# Altium schematic sheet Schéma_Global.SchDoc
size A3; Author: LDA; Organization: ETML-ES; Address1: Avenue Recordon 1; Address2: 1004 Lausanne; Address3: Switzerland; Revision: 1.0; SheetNumber: 1; SheetTotal: 2; SPICEModelCacheBXXOXYNL: <root> / <DocumentId>BXXOXYNL</DocumentId> / </root>
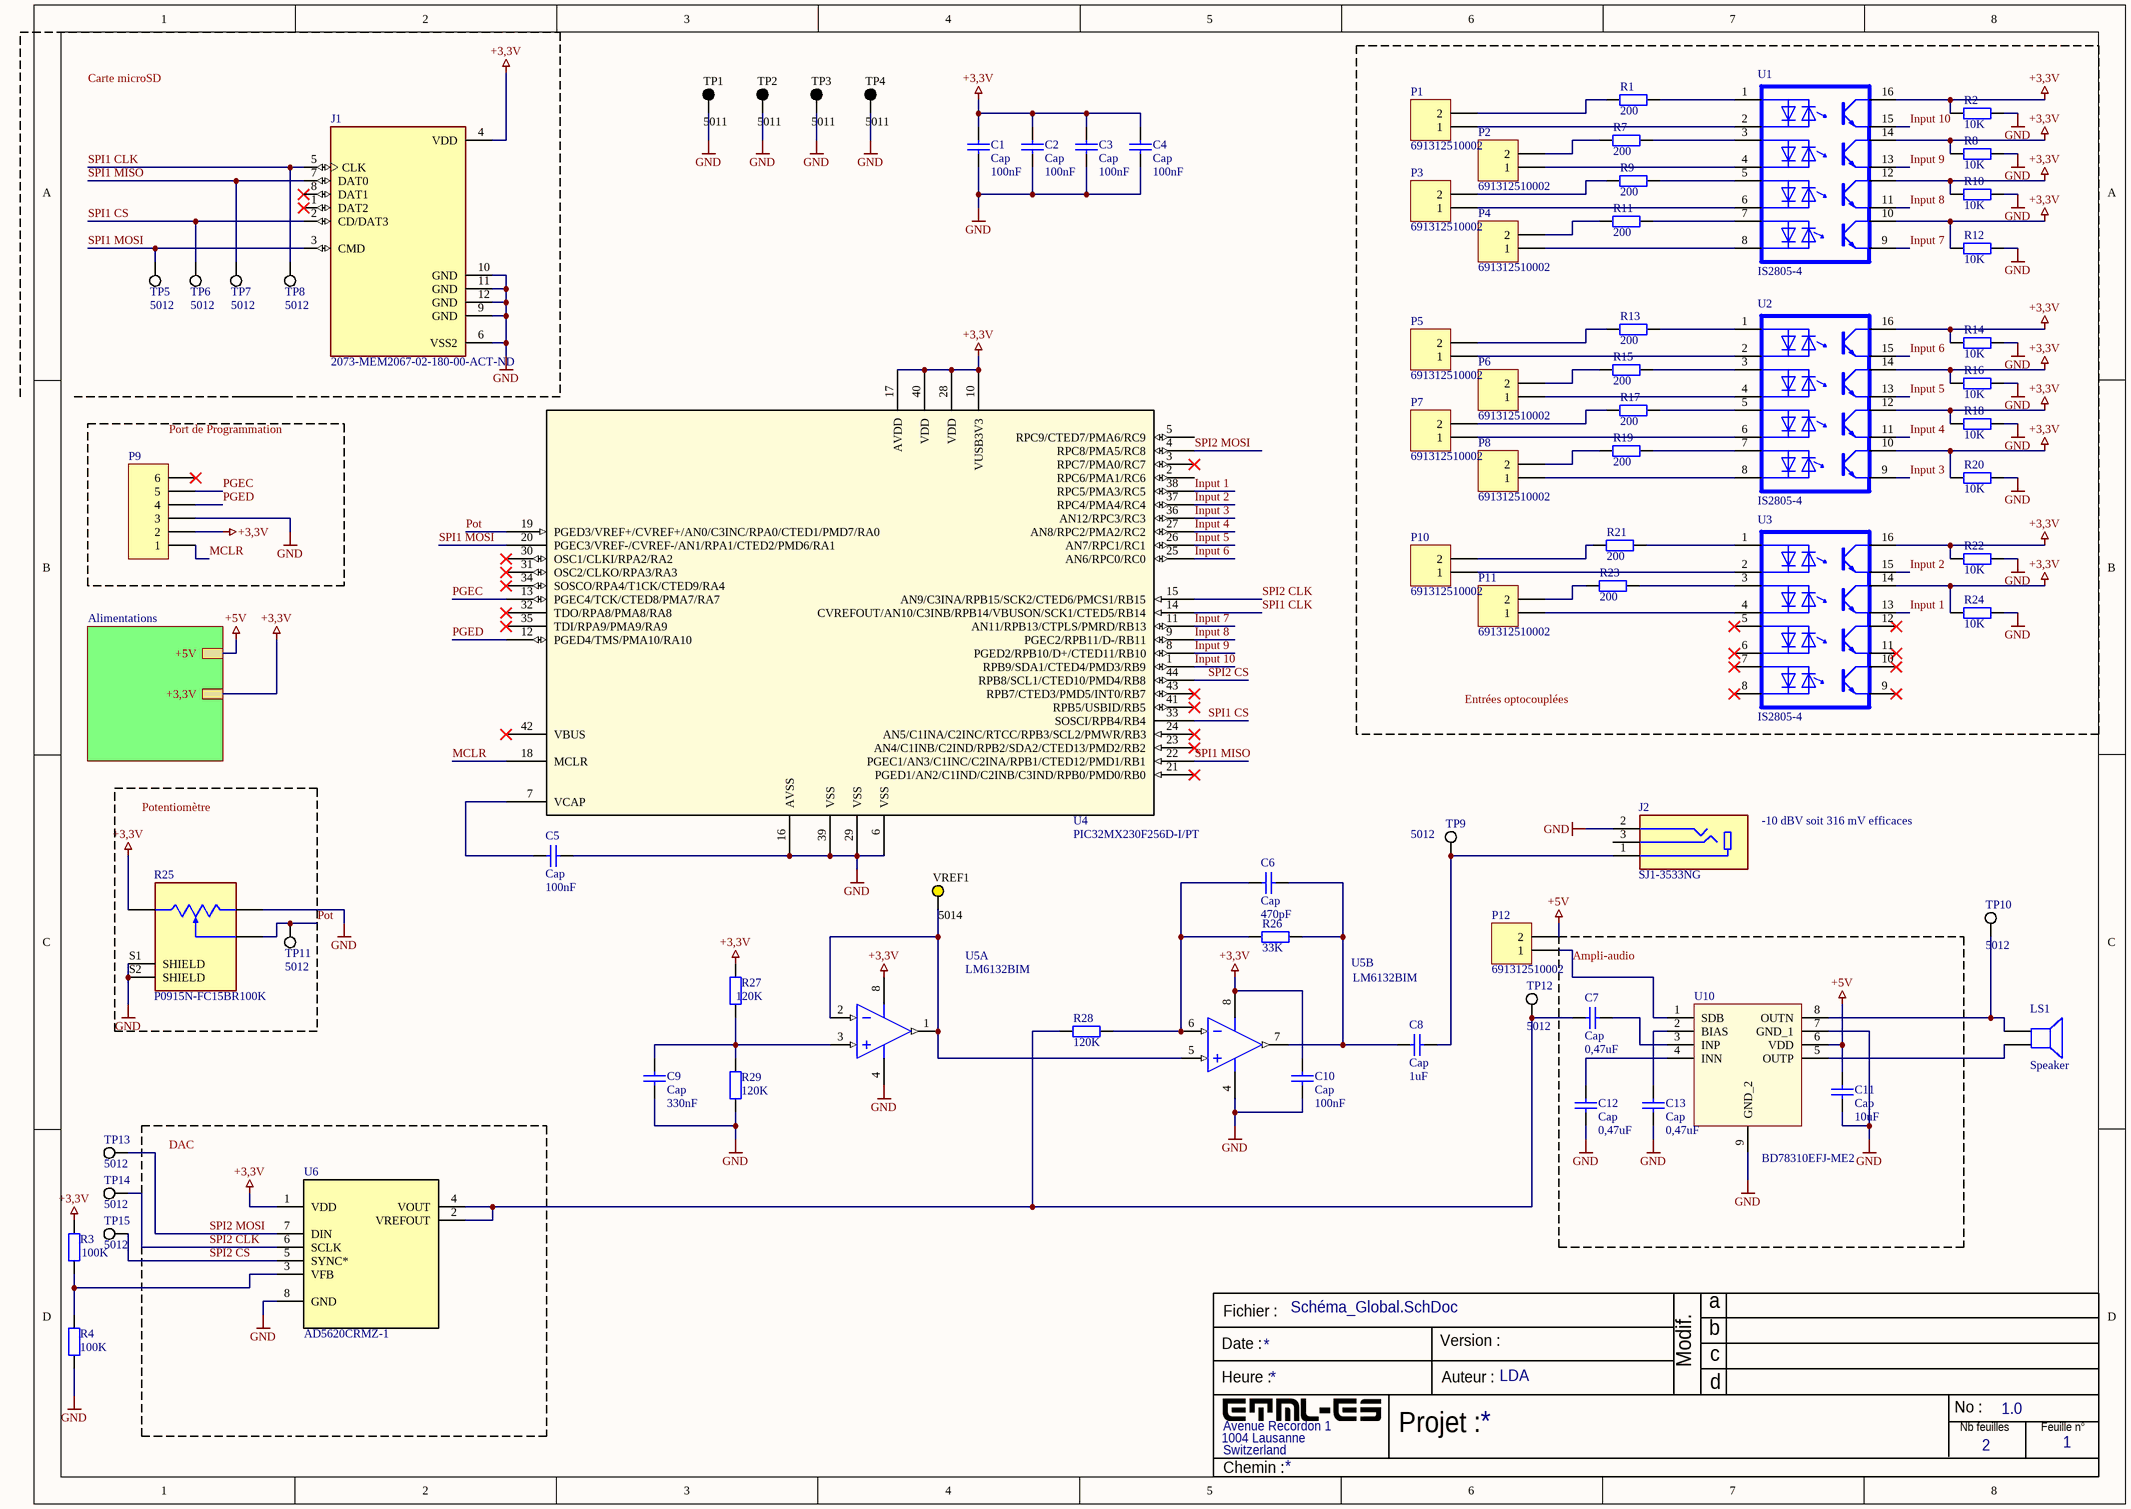
[diagram p0: Schéma_Global.SchDoc]

## Parts
C1  Cap  value 100nF  [C0805]
C2  Cap  value 100nF  [C0805]
C3  Cap  value 100nF  [C0805]
C4  Cap  value 100nF  [C0805]
C5  Cap  value 100nF  [C0805]
C6  Cap  value 470pF  [C0805]
C7  Cap  value 0,47uF  [C0805]
C8  Cap  value 1uF  [C0805]
C9  Cap  value 330nF  [C0805]
C10  Cap  value 100nF  [C0805]
C11  Cap  value 10uF  [C0805]
C12  Cap  value 0,47uF  [C0805]
C13  Cap  value 0,47uF  [C0805]
J1  2073-MEM2067-02-180-00-ACT-ND  [GCT_MEM2067-02-180-00-A_REVB]
J2  SJ1-3533NG  [CUI_SJ1-3533NG]
LS1  Speaker  [PIN2]
P1  691312510002  [691312710002]
P2  691312510002  [691312710002]
P3  691312510002  [691312710002]
P4  691312510002  [691312710002]
P5  691312510002  [691312710002]
P6  691312510002  [691312710002]
P7  691312510002  [691312710002]
P8  691312510002  [691312710002]
P9  76384-406LF  [HDR1X6]  (value not drawn)
P10  691312510002  [691312710002]
P11  691312510002  [691312710002]
P12  691312510002  [MHDR1X2]
R1  value 200  [C1206]  (hidden comment: Res2)
R2  value 10K  [C1206]  (hidden comment: Res2)
R3  value 100K  [C1206]  (hidden comment: Res2)
R4  value 100K  [C1206]  (hidden comment: Res2)
R7  value 200  [C1206]  (hidden comment: Res2)
R8  value 10K  [C1206]  (hidden comment: Res2)
R9  value 200  [C1206]  (hidden comment: Res2)
R10  value 10K  [C1206]  (hidden comment: Res2)
R11  value 200  [C1206]  (hidden comment: Res2)
R12  value 10K  [C1206]  (hidden comment: Res2)
R13  value 200  [C1206]  (hidden comment: Res2)
R14  value 10K  [C1206]  (hidden comment: Res2)
R15  value 200  [C1206]  (hidden comment: Res2)
R16  value 10K  [C1206]  (hidden comment: Res2)
R17  value 200  [C1206]  (hidden comment: Res2)
R18  value 10K  [C1206]  (hidden comment: Res2)
R19  value 200  [C1206]  (hidden comment: Res2)
R20  value 10K  [C1206]  (hidden comment: Res2)
R21  value 200  [C1206]  (hidden comment: Res2)
R22  value 10K  [C1206]  (hidden comment: Res2)
R23  value 200  [C1206]  (hidden comment: Res2)
R24  value 10K  [C1206]  (hidden comment: Res2)
R25  P0915N-FC15BR100K  [TRIM_P0915N-FC15BR100K]
R26  value 33K  [C1206]  (hidden comment: Res2)
R27  value 120K  [C1206]  (hidden comment: Res2)
R28  value 120K  [C1206]  (hidden comment: Res2)
R29  value 120K  [C1206]  (hidden comment: Res2)
TP1  5011  [KSTN-5011_V]
TP2  5011  [KSTN-5011_V]
TP3  5011  [KSTN-5011_V]
TP4  5011  [KSTN-5011_V]
TP5  5012  [KSTN-5012_V]
TP6  5012  [KSTN-5012_V]
TP7  5012  [KSTN-5012_V]
TP8  5012  [KSTN-5012_V]
TP9  5012  [KSTN-5012_V]
TP10  5012  [KSTN-5012_V]
TP11  5012  [KSTN-5012_V]
TP12  5012  [KSTN-5012_V]
TP13  5012  [KSTN-5012_V]
TP14  5012  [KSTN-5012_V]
TP15  5012  [KSTN-5012_V]
U1  IS2805-4  [Opto_SOIC]
U2  IS2805-4  [Opto_SOIC]
U3  IS2805-4  [Opto_SOIC]
U4  PIC32MX230F256D-I/PT  [TQFP44_PT_MCH]
U5  LM6132BIM  [D0008A_N]  (parts A,B of 2)
U6  AD5620CRMZ-1  [SOP65P490X110-8N]
U10  BD78310EFJ-ME2  [AOP_HASOP-J8]
VREF1  5014  [KSTN-5014_V]

## Blocks framed on the sheet
Entrées optocouplées: P1-P8 P10 P11 R1 R2 R7-R24 U1-U3
Port de Programmation: P9
Potentiomètre: R25 TP11
Ampli-audio: C7 C11-C13 U10
DAC: U6

## Sub-sheets
Alimentations = Allimentations: +5V, +3,3V

## Nets
+3,3V: C1.1 C2.1 C3.1 C4.1 C10.2 J1.4(VDD) P9.2 R2.1 R3.2 R8.1 R10.1 R12.1 R14.1 R16.1 R18.1 R20.1 R22.1 R24.1 R25.1 R27.2 U1.10(CO) U1.12(CO) U1.14(CO) U1.16(CO) U2.10(CO) U2.12(CO) U2.14(CO) U2.16(CO) U3.14(CO) U3.16(CO) U4.10(VUSB3V3) U4.17(AVDD) U4.28(VDD) U4.40(VDD) U5.8(V+) U6.1(VDD) ; sheet Alimentations/+3,3V
+5V: C11.1 P12.2 U10.6(VDD) ; sheet Alimentations/+5V
GND: C1.2 C2.2 C3.2 C4.2 C5.1 C9.1 C10.1 C11.2 C12.1 C13.1 J1.6(VSS2) J1.9(GND) J1.10(GND) J1.11(GND) J1.12(GND) J2.2 P9.3 R2.2 R4.1 R8.2 R10.2 R12.2 R14.2 R16.2 R18.2 R20.2 R22.2 R24.2 R25.3 R25.S1(SHIELD) R25.S2(SHIELD) R29.1 TP1.1 TP2.1 TP3.1 TP4.1 U4.6(VSS) U4.16(AVSS) U4.29(VSS) U4.39(VSS) U5.4(V-) U6.8(GND) U10.7(GND_1) U10.9(GND_2)
Input 1: U3.13(E) U4.38(RPC5/PMA3/RC5)
Input 2: U3.15(E) U4.37(RPC4/PMA4/RC4)
Input 3: U2.9(E) U4.36(AN12/RPC3/RC3)
Input 4: U2.11(E) U4.27(AN8/RPC2/PMA2/RC2)
Input 5: U2.13(E) U4.26(AN7/RPC1/RC1)
Input 6: U2.15(E) U4.25(AN6/RPC0/RC0)
Input 7: U1.9(E) U4.11(AN11/RPB13/CTPLS/PMRD/RB13)
Input 8: U1.11(E) U4.9(PGEC2/RPB11/D-/RB11)
Input 9: U1.13(E) U4.8(PGED2/RPB10/D+/CTED11/RB10)
Input 10: U1.15(E) U4.1(RPB9/SDA1/CTED4/PMD3/RB9)
MCLR: P9.1 U4.18(MCLR)
PGEC: P9.5 U4.13(PGEC4/TCK/CTED8/PMA7/RA7)
PGED: P9.4 U4.12(PGED4/TMS/PMA10/RA10)
Pot: R25.2 TP11.1 U4.19(PGED3/VREF+/CVREF+/AN0/C3INC/RPA0/CTED1/PMD7/RA0)
SPI1 CLK: J1.5(CLK) TP8.1 U4.14(CVREFOUT/AN10/C3INB/RPB14/VBUSON/SCK1/CTED5/RB14)
SPI1 CS: J1.2(CD/DAT3) TP6.1 U4.33(SOSCI/RPB4/RB4)
SPI1 MISO: J1.7(DAT0) TP7.1 U4.22(PGEC1/AN3/C1INC/C2INA/RPB1/CTED12/PMD1/RB1)
SPI1 MOSI: J1.3(CMD) TP5.1 U4.20(PGEC3/VREF-/CVREF-/AN1/RPA1/CTED2/PMD6/RA1)
SPI2 CLK: TP14.1 U4.15(AN9/C3INA/RPB15/SCK2/CTED6/PMCS1/RB15) U6.6(SCLK)
SPI2 CS: TP15.1 U4.44(RPB8/SCL1/CTED10/PMD4/RB8) U6.5(SYNC*)
SPI2 MOSI: TP13.1 U4.4(RPC8/PMA5/RC8) U6.7(DIN)
NetC5_2: C5.2 U4.7(VCAP)
NetC6_1: C6.1 C8.2 R26.2 U5.7(OUTB)
NetC6_2: C6.2 R26.1 R28.2 U5.6(INB-)
NetC7_1: C7.1 U10.3(INP)
NetC7_2: C7.2 R28.1 TP12.1 U6.2(VREFOUT) U6.4(VOUT)
NetC8_1: C8.1 J2.1 TP9.1
NetC9_2: C9.2 R27.1 R29.2 U5.3(INA+)
NetC12_2: C12.2 U10.4(INN)
NetC13_2: C13.2 U10.2(BIAS)
NetLS1_1: LS1.1 TP10.1 U10.8(OUTN)
NetLS1_2: LS1.2 U10.5(OUTP)
NetP1_1: P1.1 U1.2(C)
NetP1_2: P1.2 R1.1
NetP2_1: P2.1 U1.4(C)
NetP2_2: P2.2 R7.1
NetP3_1: P3.1 U1.6(C)
NetP3_2: P3.2 R9.1
NetP4_1: P4.1 U1.8(C)
NetP4_2: P4.2 R11.1
NetP5_1: P5.1 U2.2(C)
NetP5_2: P5.2 R13.1
NetP6_1: P6.1 U2.4(C)
NetP6_2: P6.2 R15.1
NetP7_1: P7.1 U2.6(C)
NetP7_2: P7.2 R17.1
NetP8_1: P8.1 U2.8(C)
NetP8_2: P8.2 R19.1
NetP10_1: P10.1 U3.2(C)
NetP10_2: P10.2 R21.1
NetP11_1: P11.1 U3.4(C)
NetP11_2: P11.2 R23.1
NetP12_1: P12.1 U10.1(SDB)
NetR1_2: R1.2 U1.1(A)
NetR3_1: R3.1 R4.2 U6.3(VFB)
NetR7_2: R7.2 U1.3(A)
NetR9_2: R9.2 U1.5(A)
NetR11_2: R11.2 U1.7(A)
NetR13_2: R13.2 U2.1(A)
NetR15_2: R15.2 U2.3(A)
NetR17_2: R17.2 U2.5(A)
NetR19_2: R19.2 U2.7(A)
NetR21_2: R21.2 U3.1(A)
NetR23_2: R23.2 U3.3(A)
NetU5_1: U5.1(OUTA) U5.2(INA-) U5.5(INB+) VREF1.1

Not connected (* = marked no-connect by the designer): J1 1(DAT2)* 8(DAT1)*; J2 3; P9 6*; U3 5(A)* 6(C)* 7(A)* 8(C)* 9(E)* 10(CO)* 11(E)* 12(CO)*; U4 2(RPC6/PMA1/RC6) 3(RPC7/PMA0/RC7)* 5(RPC9/CTED7/PMA6/RC9) 21(PGED1/AN2/C1IND/C2INB/C3IND/RPB0/PMD0/RB0)* 23(AN4/C1INB/C2IND/RPB2/SDA2/CTED13/PMD2/RB2)* 24(AN5/C1INA/C2INC/RTCC/RPB3/SCL2/PMWR/RB3)* 30(OSC1/CLKI/RPA2/RA2)* 31(OSC2/CLKO/RPA3/RA3)* 32(TDO/RPA8/PMA8/RA8)* 34(SOSCO/RPA4/T1CK/CTED9/RA4)* 35(TDI/RPA9/PMA9/RA9)* 41(RPB5/USBID/RB5)* 42(VBUS)* 43(RPB7/CTED3/PMD5/INT0/RB7)*

## Notes on the sheet
- Carte microSD
- -10 dBV soit 316 mV efficaces
- Fichier :
- a
- Date :
- Heure :
- Version :
- Auteur :
- Modif.
- b
- c
- d
- Projet :
- No :
- Nb feuilles
- Feuille n°
- Chemin :

## Library data of the parts
C1-C13 = Cap: Capacitor; Published: 8-Jun-2000; LatestRevisionDate: 17-Jul-2002; LatestRevisionNote: Re-released for DXP Platform.; PackageReference: RAD-0.3; Publisher: Altium Limited; PackageDescription: Radial Cap, Thru-Hole; 2 Leads; 0.3 in Pin Spacing
J1 = GMC020080HR: 2 In 1 Connector Sd+mmc; MF: Amphenol ICC (Commercial Products); MP: GMC020080HR; Check_prices: https://www.snapeda.com/parts/GMC020080HR/Amphenol+Commercial+Products/view-part/?ref=eda; Availability: In Stock; Purchase-URL: https://pricing.snapeda.com/search/part/GMC020080HR/?ref=eda; Package: None; Value: *; SnapEDA_Link: https://www.snapeda.com/parts/GMC020080HR/Amphenol+Commercial+Products/view-part/?ref=snap; Price: None
J2 = SJ1-3533NG: 3.5 mm Right-Angle Stereo Jack, 3 Pin PCB Mount, Isolated Ground; MF: {'manufacturer': u'CUI'}; Price: None; Availability: Unavailable; Package: None; MP: SJ1-3533NG; Value: *
LS1 = Speaker: Loudspeaker; Published: 24-Mar-1999; LatestRevisionDate: 17-Jul-2002; LatestRevisionNote: Re-released for DXP Platform.; PackageReference: PIN2; Publisher: Altium Limited
P1-P8 P10-P12 = MHDR1X2: Header, 2-Pin; LatestRevisionDate: 17-Jul-2002; LatestRevisionNote: Re-released for DXP Platform.; Publisher: Altium Limited
P9 = Header 6: Header, 6-Pin; LatestRevisionDate: 17-Jul-2002; LatestRevisionNote: Re-released for DXP Platform.; Publisher: Altium Limited
R1-R4 R7-R24 R26-R29 = Res2: Resistor; Published: 8-Jun-2000; LatestRevisionDate: 17-Jul-2002; LatestRevisionNote: Re-released for DXP Platform.; PackageReference: AXIAL-0.4; Publisher: Altium Limited; PackageDescription: Axial Device, Thru-Hole; 2 Leads; 0.4 in Pin Spacing
R25 = P0915N-FC15BR100K: Res Conductive Plastic POT 100K Ohm 20% 0.05W(1/20W) 1(Elec)/1(Mech)Turns 6mm (12.1 X 14.85 X 28.5mm) Pin Panel Mount/Through Hole Box/Tray; MF: BI Technologies (TT electronics); Check_prices: https://www.snapeda.com/parts/P0915N-FC15BR100K/BI+Technologies/view-part/?ref=eda; Value: *; Availability: In Stock; MP: P0915N-FC15BR100K; Price: None; Package: None; SnapEDA_Link: https://www.snapeda.com/parts/P0915N-FC15BR100K/BI+Technologies/view-part/?ref=snap; Purchase-URL: https://pricing.snapeda.com/search/part/P0915N-FC15BR100K/?ref=eda
TP1-TP4 = CMP-1672-00003-4: Test Point, Black, Through Hole, RoHS, Bulk; Manufacturer: Keystone; ComponentLink2URL: http://www.keyelco.com/product-pdf.cfm?p=1320; Colour: Black; Pins: 1; REACH SVHC: No SVHC; ComponentLink1URL: http://www.keyelco.com/; PackageReference: 5011; Contact Plating: Silver; Package Quantity: 100; Packaging: Bulk; RoHSCompliant: true; Height: 8.12 mm; PackageDescription: 1-Pin Through Hole Device, Dia 3.17 mm; Mount: Through Hole; Mounting Technology: Through Hole; DatasheetVersion: Rev. F, 12/2013; ComponentLink1Description: Manufacturer URL; Contact Material: Bronze; ComponentLink2Description: Datasheet
TP5-TP15 = CMP-1672-00004-4: Test Point, White, Through Hole, RoHS, Bulk; Manufacturer: Keystone; DatasheetVersion: Rev. F, 12/2013; ComponentLink1URL: http://www.keyelco.com/; PackageReference: 5012; RoHSCompliant: true; ComponentLink2Description: Datasheet; Colour: White; Contact Material: Bronze; PackageDescription: 1-Pin Through Hole Device, Dia 3.17 mm; Mounting Technology: Through Hole; Mount: Through Hole; Package Quantity: 100; ComponentLink1Description: Manufacturer URL; Pins: 1; Height: 8.12 mm; Packaging: Bulk; REACH SVHC: No SVHC; Contact Plating: Silver; Length: 11.3 mm; ComponentLink2URL: http://www.keyelco.com/product-pdf.cfm?p=1321
U1-U3 = IS2805-4: MP: VOS615A-1X001T; Package: None; Price: None; Value: *; Availability: Unavailable
U4 = PIC32MX230F256D-I/PT: No Description Available; Mfr_Name: Microchip; Copyright: Copyright (C) 2023 Ultra Librarian. All rights reserved.; Manufacturer_Part_Number: PIC32MX230F256D-I/PT; RefDes: RefDes; Type: DEV
U5 = CMP-0055-00790-3: Dual Low Power 10 MHz Rail-to-Rail I/O Operational Amplifier, 8-pin Narrow SOIC; Manufacturer: Texas Instruments; CompType: Amplifiers; PowerWise: N; PackageTopMarking: NSZXTT*LM61*32BIM; Package Reference: D0008A; Code_IPC: SOIC127P600-8; PinCount: 8; ComponentLink1Description: Datasheet URL; PackageDescription: SOIC Narrow, 4.9 x 3.9 x 1.45mm, 8 Lead, 1.27mm Pitch; RoHS: N; ComponentLink1URL: http://www.ti.com/general/docs/lit/getliterature.tsp?genericPartNumber=LM6132&fileType=pdf; Code_JEDEC: MS-012-AA
U6 = AD5620CRMZ-1: Single, 12-Bit nanoDACÂ® with 5 ppm/Â°C On-Chip Reference in SOT-23; MF: Analog Devices; Value: *; Price: None; Package: MSOP-8 Analog Devices; MP: AD5620CRMZ-1; Purchase-URL: https://pricing.snapeda.com/search/part/AD5620CRMZ-1/?ref=eda; SnapEDA_Link: https://www.snapeda.com/parts/AD5620CRMZ-1/Analog+Devices/view-part/?ref=snap; Check_prices: https://www.snapeda.com/parts/AD5620CRMZ-1/Analog+Devices/view-part/?ref=eda; Availability: In Stock
U10 = BD78310EFJ-ME2: 1.2W MONAURAL SPEAKER AMPLIFIER; Manufacturer_Name: ROHM Semiconductor; Geometry.Height: 1mm; Manufacturer_Part_Number: BD78310EFJ-ME2; Mouser Part Number: 755-BD78310EFJ-ME2; Mouser Price/Stock: https://www.mouser.co.uk/ProductDetail/ROHM-Semiconductor/BD78310EFJ-ME2?qs=BJlw7L4Cy78WwGkJ9o75rg%3D%3D; Arrow Part Number: *; Arrow Price/Stock: *; Mouser Testing Part Number: *; Mouser Testing Price/Stock: *; Datasheet Link: http://www.farnell.com/datasheets/2976892.pdf
VREF1 = CMP-1672-00006-4: Test Point, Yellow, Through Hole, RoHS, Bulk; Manufacturer: Keystone; PackageDescription: 1-Pin Through Hole Device, Dia 3.17 mm; REACH SVHC: No SVHC; ComponentLink2Description: Datasheet; ComponentLink2URL: http://www.keyelco.com/product-pdf.cfm?p=1323; Package Quantity: 100; Colour: Yellow; Height: 8.12 mm; RoHSCompliant: true; Contact Material: Bronze; Mount: Through Hole; Contact Plating: Silver; ComponentLink1URL: http://www.keyelco.com/; Packaging: Bulk; Mounting Technology: Through Hole; PackageReference: 5014; ComponentLink1Description: Manufacturer URL; DatasheetVersion: Rev. F, 12/2013